# EAGLE design AccessBadgeV1.0 (EAGLE 7.3.0)
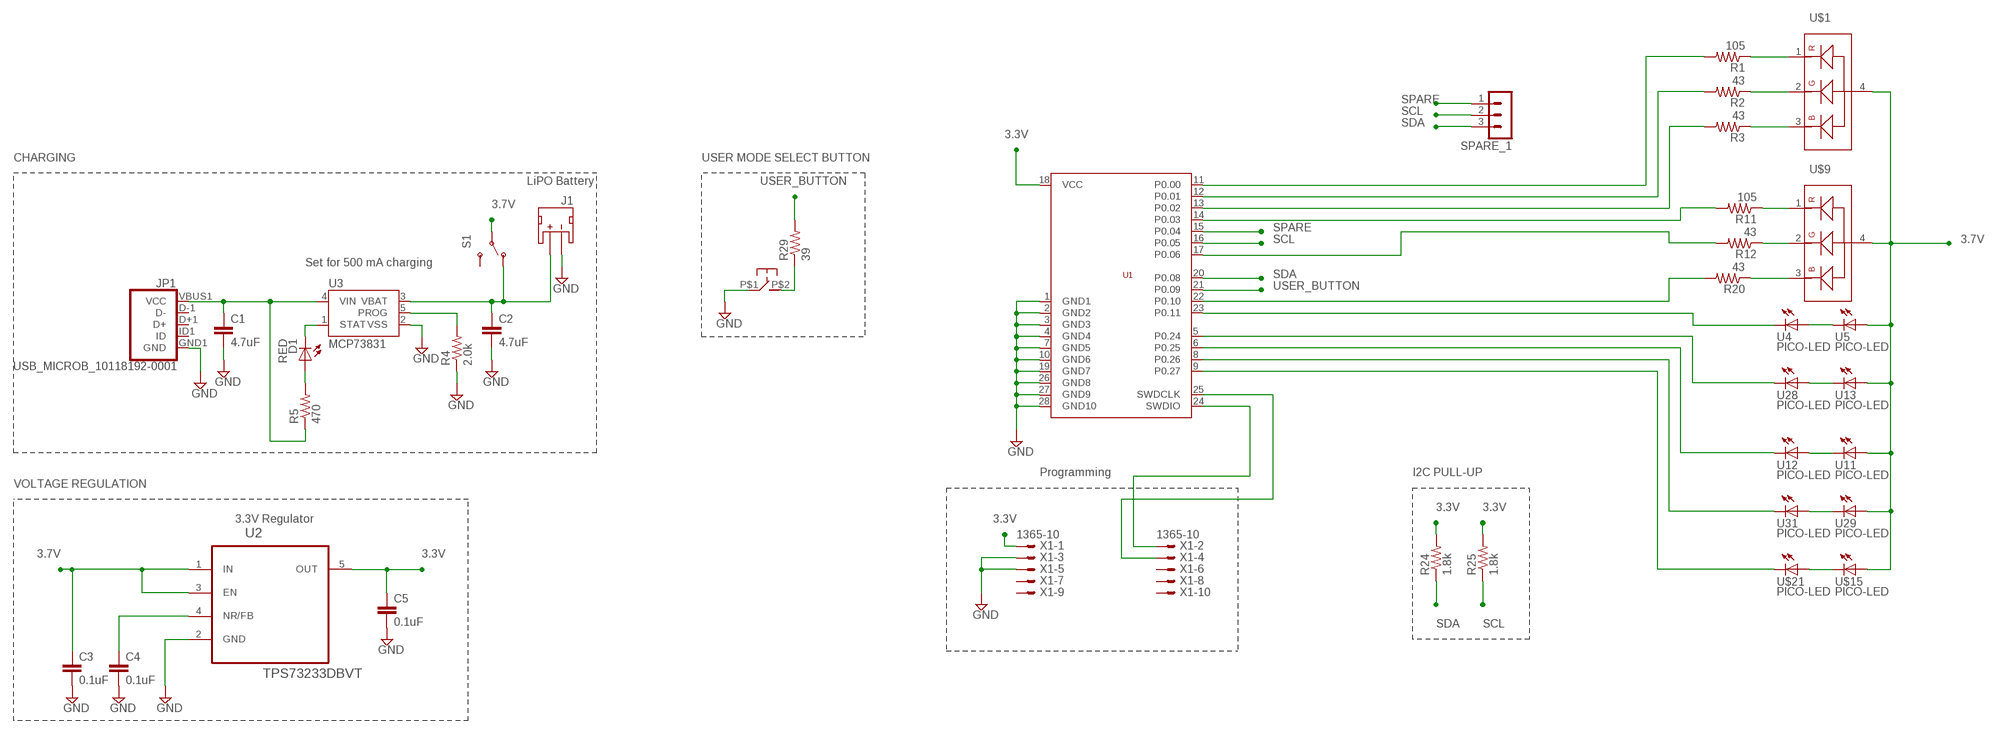
[diagram p0: schematic, sheet 1]

## Parts
C1  4.7uF  CAP0603-CAP  [0603-CAP]
C2  4.7uF  CAP0603-CAP  [0603-CAP]
C3  0.1uF  C-EUC0201  [C0201]
C4  0.1uF  C-EUC0201  [C0201]
C5  0.1uF  C-EUC0201  [C0201]
D1  RED  LEDCHIP-LED0603  [CHIP-LED0603]
J1  JST_2MM_MALE  [JST-2-SMD]
JP1  USB_MICROB_10118192-0001  USB_MICROB_PLUGCONN-11752  [USB-B-MICRO-SMD_V03]
R1  105  R-US_R0201  [R0201]
R2  43  R-US_R0201  [R0201]
R3  43  R-US_R0201  [R0201]
R4  2.0k  R-US_R0201  [R0201]
R5  470  R-US_R0201  [R0201]
R11  105  R-US_R0201  [R0201]
R12  43  R-US_R0201  [R0201]
R20  43  R-US_R0201  [R0201]
R24  1.8k  R-US_R0201  [R0201]
R25  1.8k  R-US_R0201  [R0201]
R29  39  R-US_R0201  [R0201]
S1  SWITCH-SPDTSMD2  [SWITCH-SPDT-SMD]
SLC  TACTILE_BUTTON  [KXT131]
SPARE_1  MA03-1  [MA03-1]
U1  BMD-200  [BMD-200]
U2  TPS73233DBVT  [SOT95P280X145-5N]
U3  MCP73831  [SOT23-5]
U4  PICO-LED  [CHIP-LED0402]
U5  PICO-LED  [CHIP-LED0402]
U11  PICO-LED  [CHIP-LED0402]
U12  PICO-LED  [CHIP-LED0402]
U13  PICO-LED  [CHIP-LED0402]
U28  PICO-LED  [CHIP-LED0402]
U29  PICO-LED  [CHIP-LED0402]
U31  PICO-LED  [CHIP-LED0402]
U$1  RGB  [0606]
U$9  RGB  [0606]
U$15  PICO-LED  [CHIP-LED0402]
U$21  PICO-LED  [CHIP-LED0402]
X1  1365-10  [1365-10]

## Nets
3.3V: C5.1 R24.2 R25.2 U1.18(VCC) U2.5(OUT) X1.1
3.7V: C3.1 S1.2(P) U2.1(IN) U2.3(EN) U5.P$1(A) U11.P$1(A) U13.P$1(A) U29.P$1(A) U$1.4 U$9.4 U$15.P$1(A)
GND: C1.2 C2.2 C3.2 C4.2 C5.2 J1.1(-) JP1.GND1(GND) R4.1 SLC.P$1 U1.1(GND1) U1.2(GND2) U1.3(GND3) U1.4(GND4) U1.7(GND5) U1.10(GND6) U1.19(GND7) U1.26(GND8) U1.27(GND9) U1.28(GND10) U2.2(GND) U3.2(VSS) X1.3 X1.5
N$1: R1.2 U1.11(P0.00)
N$2: R2.2 U1.12(P0.01)
N$3: R3.2 U1.13(P0.02)
N$4: R11.2 U1.14(P0.03)
N$5: U1.5(P0.24) U28.P$2(C)
N$6: U1.9(P0.27) U$21.P$2(C)
N$9: U4.P$1(A) U5.P$2(C)
N$10: U1.23(P0.11) U4.P$2(C)
N$15: R1.1 U$1.1
N$16: R2.1 U$1.2
N$17: R3.1 U$1.3
N$28: R4.2 U3.5(PROG)
N$29: C1.1 JP1.VBUS1(VCC) R5.1 U3.4(VIN)
N$35: D1.A R5.2
N$36: D1.C U3.1(STAT)
N$39: R11.1 U$9.1
N$41: R12.1 U$9.2
N$49: C4.1 U2.4(NR/FB)
N$50: U$15.P$2(C) U$21.P$1(A)
N$52: U29.P$2(C) U31.P$1(A)
N$53: U11.P$2(C) U12.P$1(A)
N$54: U13.P$2(C) U28.P$1(A)
N$64: R20.1 U$9.3
N$66: U1.8(P0.26) U31.P$2(C)
N$67: U1.6(P0.25) U12.P$2(C)
N$69: R20.2 U1.22(P0.10)
N$70: R12.2 U1.17(P0.06)
N$75: R29.1 SLC.P$2
N$76: U1.24(SWDIO) X1.2
N$77: U1.25(SWDCLK) X1.4
SCL: R25.1 SPARE_1.2 U1.16(P0.05)
SDA: R24.1 SPARE_1.3 U1.20(P0.08)
SPARE: SPARE_1.1 U1.15(P0.04)
USER_BUTTON: R29.2 U1.21(P0.09)
VBAT1: C2.1 J1.2(+) S1.1(O) U3.3(VBAT)
Unconnected: J1.NC1(PAD1) J1.NC2(PAD2) JP1.D+1(D+) JP1.D-1(D-) JP1.ID1(ID) S1.3(S) X1.6 X1.7 X1.8 X1.9 X1.10

## Notes on the sheet
- CHARGING | USER MODE SELECT BUTTON
- LiPO Battery
- Set for 500 mA charging
- Programming | I2C PULL-UP
- VOLTAGE REGULATION
- 3.3V Regulator

## Library data of the parts
C1 C2 = SparkFun:CAP: Capacitor Standard 0603 ceramic capacitor, and 0.1" leaded capacitor.
C3-C5 = rcl:C-EU: CAPACITOR, European symbol
D1 = adafruit:LED: LED OSRAM: - CHIPLED LG R971, LG N971, LY N971, LG Q971, LY Q971, LO R971, LY R971 LH N974, LH R974 LS Q976, LO Q976, LY Q976 LO Q996 - Hyper CHIPLED LW Q18S LB Q993, LB Q99A, LB R99A - SideLED LS A670, LO A670, LY A670, LG A670, LP A670 LB A673, LV A673, LT A673, LW A673 LH A674 LY A675 LS A676, LA A676, LO A676, LY A676, LW A676 LS A679, LY A679, LG A679 - Hyper Micro SIDELED® LS Y876, LA Y876, LO Y876, LY Y876 LT Y87S - SmartLED LW L88C, LW L88S LB L89C, LB L89S, LG L890 LS L89K, LO L89K, LY L89K LS L896, LA L896, LO L896, LY L896 - TOPLED LS T670, LO T670, LY T670, LG T670, LP T670 LSG T670, LSP T670, LSY T670, LOP T670, LYG T670 LG T671, LOG T671, LSG T671 LB T673, LV T673, LT T673, LW T673 LH T674 LS T676, LA T676, LO T676, LY T676, LB T676, LH T676, LSB T676, LW T676 LB T67C, LV T67C, LT T67C, LS T67K, LO T67K, LY T67K, LW E67C LS E67B, LA E67B, LO E67B, LY E67B, LB E67C, LV E67C, LT E67C LW T67C LS T679, LY T679, LG T679 LS T770, LO T770, LY T770, LG T770, LP T770 LB T773, LV T773, LT T773, LW T773 LH T774 LS E675, LA E675, LY E675, LS T675 LS T776, LA T776, LO T776, LY T776, LB T776 LHGB T686 LT T68C, LB T68C - Hyper Mini TOPLED® LB M676 - Mini TOPLED Santana® LG M470 LS M47K, LO M47K, LY M47K Source: http://www.osram.convergy.de/
J1 = SparkFun-Connectors:JST_2MM_MALE: Mates to single-cell LiPo batteries. CONN-08352; PROD_ID: CONN-08352
JP1 = SparkFun-Connectors:USB_MICROB_PLUG: USB Micro-B Plug Comes in a variety of packages. Check out Hirose's ZX-x0 line: http://www.hirose.co.jp/cataloge_hp/e24200011.pdf; PROD_ID: CONN-11752
R1-R5 R11 R12 R20 R24 R25 R29 = rcl:R-US_: RESISTOR, American symbol
S1 = SparkFun-Electromechanical:SWITCH-SPDT: SPDT Switch Simple slide switch, Spark Fun Electronics SKU : COM-00102 DPDT SMT slide switch, AYZ0202, SWCH-08179
SLC = C_K_BUTTONS:TACTILE_BUTTON
SPARE_1 = con-lstb:MA03-1: PIN HEADER; OC_FARNELL: unknown; OC_NEWARK: unknown
U1 = BMD-200:BMD-200
U2 = Texas Instruments_By_element14_Batch_1:TPS73233DBVT: Cap-Free, NMOS, 250mA Low Dropout Regulator with Reverse Current Protection; MPN: TPS73233DBVT; OC_FARNELL: -; OC_NEWARK: 87H2968; PACKAGE: SOT-23-5; SUPPLIER: Texas Instruments
U3 = SparkFun:MCP73831: Microchip's MCP73831 Miniature single cell, fully integrated Li-Ion, Li-polymer charge management controller http://ww1.microchip.com/downloads/en/DeviceDoc/21984a.pdf
U4 U5 U11-U13 U28 U29 U31 U$15 U$21 = adafruit:PICO-LED
U$1 U$9 = LITE_ON:RGB
X1 = con-leotronics:1365-10: DUAL ROW STRAIGHT HEADER 1364 SERIES. 1.27mm x 1.27mm. Without Fixing Post. SMT Source: http://www.leotronics.co.uk/Conexcon/Data%20Sheets/sec.%20A/1364ing.pdf; OC_FARNELL: unknown; OC_NEWARK: unknown

## Board
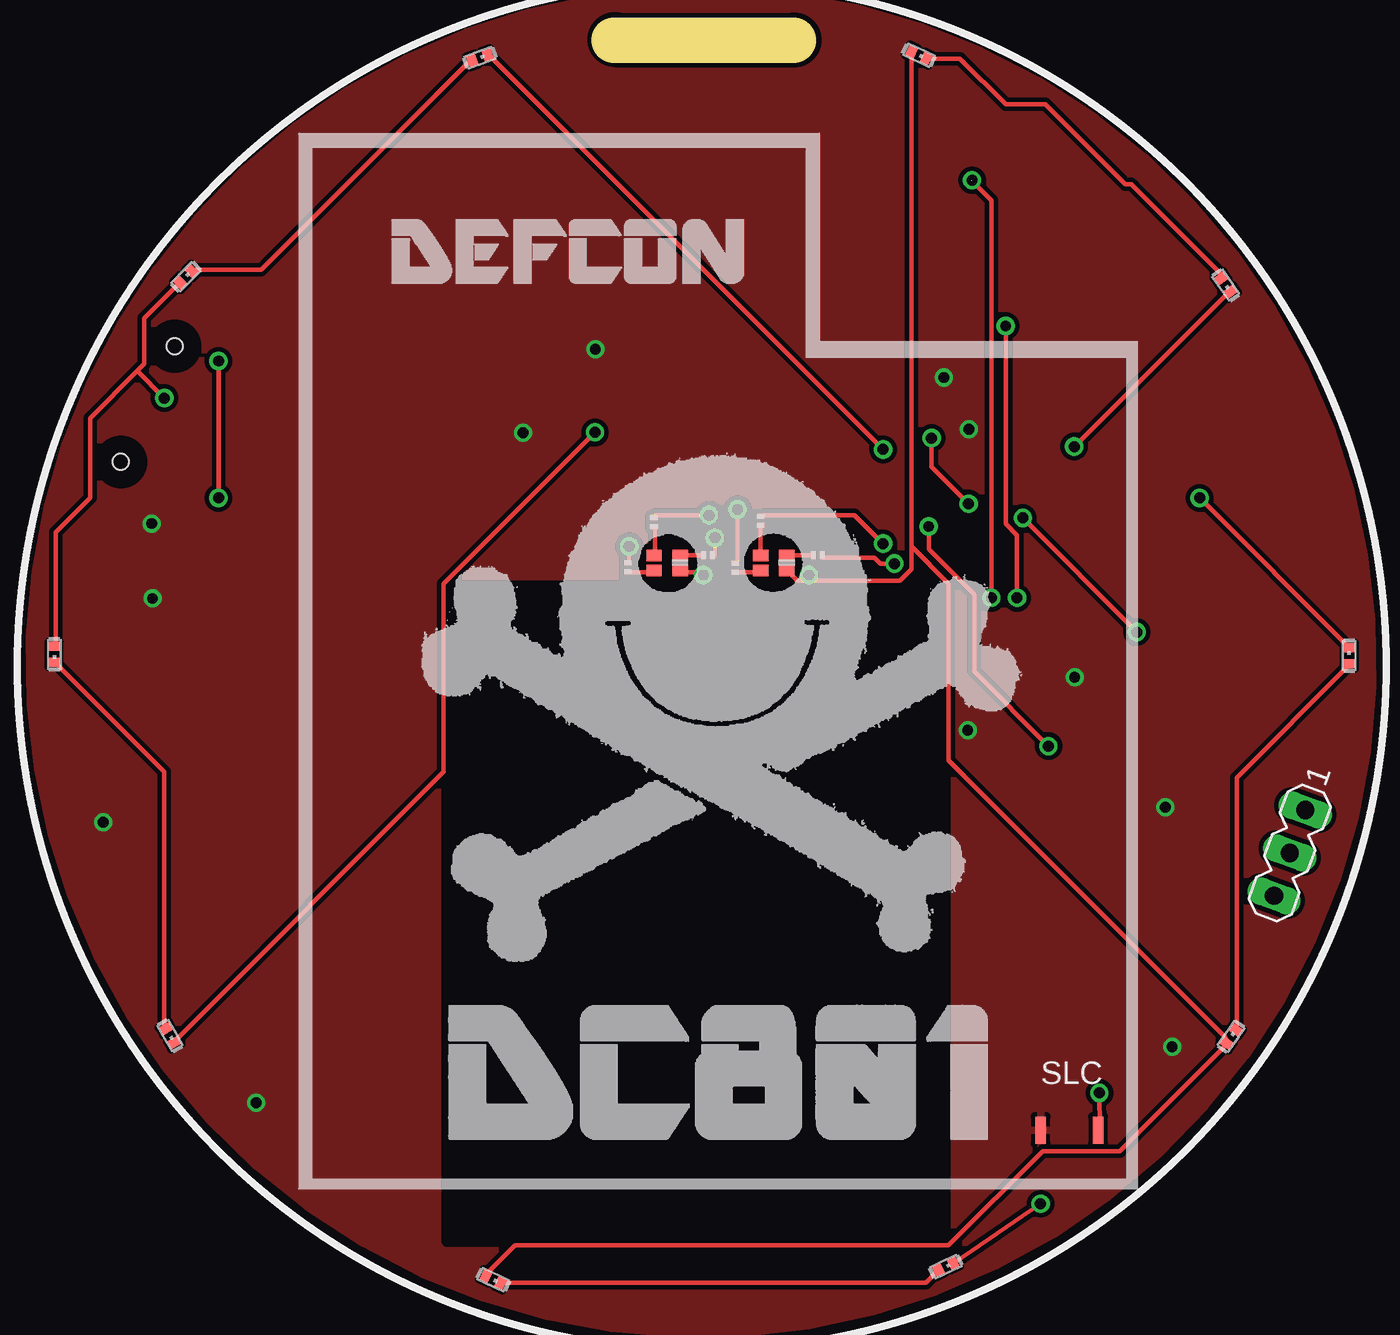
[diagram p1: board, top side]
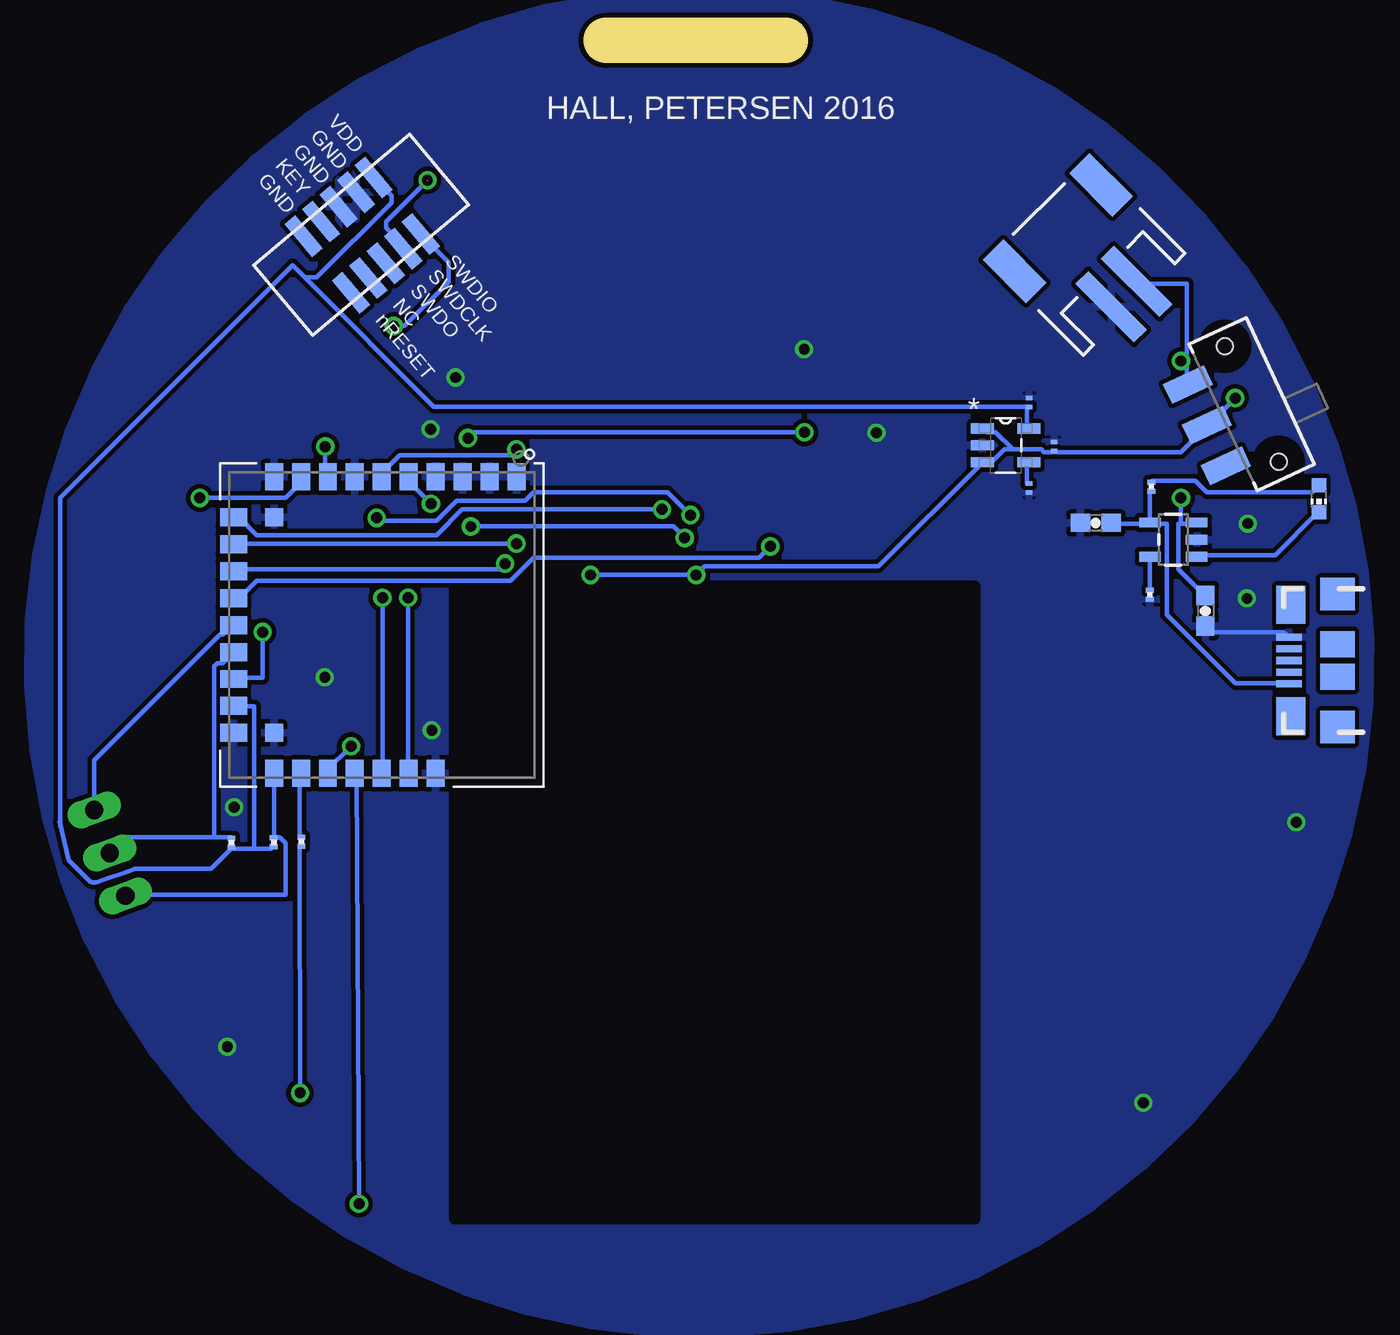
[diagram p2: board, bottom side, seen from below]

No outline drawn. Coordinates in mm, seen from the top.
Copper layers (1*16): Top 0.035mm / dielectric 1.5mm / Bottom 0.035mm
Design rules "default": minimum track width 10mil, minimum drill 24mil, track to track 8mil, track to pad 8mil, pad to pad 8mil, via to via 8mil, smd to smd 8mil, copper to edge 40mil, drill to drill 8mil, minimum pad ring 10mil, minimum via ring 8mil, stop-mask expansion 4mil, vias tented up to drill 0mil, thermal gap 10mil
tRestrict: 1 lines
bRestrict: 1 lines
Milling: 1 lines

### Footprints (pad centres in the part's own frame; a part is rotated, then mirrored left to right if it is on the bottom)
0603-CAP = smd 1.1 x 1: 1 -0.85,0; 2 0.85,0
C0201 = smd 0.25 x 0.35: 1 -0.25,0; 2 0.25,0
CHIP-LED0603 = smd 0.8 x 0.8: A 0,-0.75; C 0,0.75
JST-2-SMD = smd 1 x 4.6: 1 -1,-3.7; 2 1,-3.7 | smd 1.6 x 3.4: NC1 -3.4,1.5; NC2 3.4,1.5
USB-B-MICRO-SMD_V03 = smd 1.4 x 0.4: D+1 2.7,0; D-1 2.7,0.65; GND1 2.7,-1.3; ID1 2.7,-0.65; VBUS1 2.7,1.3 | smd 1.9 x 1.45: P$1 0,-0.9; P$2 0,0.9 | smd 1.9 x 1.8: P$3 0,3.7; P$4 0,-3.7 | smd 1.6 x 2.1: P$5 2.6,3.1; P$6 2.6,-3.1
R0201 = smd 0.28 x 0.43: 1 -0.255,0; 2 0.255,0
SWITCH-SPDT-SMD = smd 1.2 x 2.5: 1 -2.5,-2.75; 2 0,-2.75; 3 2.5,-2.75 | hole 0.9: -3.55,0; 3.55,0
KXT131 = smd 0.6 x 1.5: P$1 0,0; P$2 3.2,0
MA03-1 = drill 1.016 long: 1 -2.54,0; 2 0,0; 3 2.54,0
BMD-200 = smd 1 x 1.5: 1 -7.5,-8.25; 2 -6,-8.25; 3 -4.5,-8.25; 4 -3,-8.25; 5 -1.5,-8.25; 6 0,-8.25; 7 1.5,-8.25; 8 3,-8.25; 9 4.5,-8.25; 10 6,-8.25; 20 6,8.25; 21 4.5,8.25; 22 3,8.25; 23 1.5,8.25; 24 0,8.25; 25 -1.5,8.25; 26 -3,8.25 | smd 1.5 x 1: 11 8.25,-6; 12 8.25,-4.5; 13 8.25,-3; 14 8.25,-1.5; 15 8.25,0; 16 8.25,1.5; 17 8.25,3; 18 8.25,4.5; 19 8.25,6 | smd 1 x 1: 27 6,-6; 28 6,6
SOT95P280X145-5N = smd 1.27 x 0.559: 1 -1.295,0.94; 2 -1.295,0; 3 -1.295,-0.94; 4 1.295,-0.94; 5 1.295,0.94
SOT23-5 = smd 0.55 x 1.2: 1 -0.95,-1.3; 2 0,-1.3; 3 0.95,-1.3; 4 0.95,1.3; 5 -0.95,1.3
CHIP-LED0402 = smd 0.5 x 0.6: P$1 0,0; P$2 0.9,0
0606 = smd 0.65 x 0.85: 1 0,0; 2 0.85,0; 3 0.85,-1.45; 4 0,-1.45
1365-10 = smd 0.76 x 2.4: 1 -2.54,-2.95; 2 -2.54,1.15; 3 -1.27,-2.95; 4 -1.27,1.15; 5 0,-2.95; 6 0,1.15; 7 1.27,-2.95; 8 1.27,1.15; 9 2.54,-2.95; 10 2.54,1.15

### Placement (x,y rotation side)
C1  15.06,47.67 180 bottom
C2  8.96,42.77 270 bottom
C3  17.37,51.92 90 bottom
C4  18.78,49.6 270 bottom
C5  18.78,54.38 90 bottom
D1  2.64,49.01 180 bottom
J1  16.11,63.01 45 bottom
JP1  1.61,40.01 180 bottom
R1  39.08,45.17 90 top
R2  40.5,47.79 90 top
R3  43.69,45.86 0 top
R4  12.05,43.67 90 bottom
R5  11.97,49.68 90 bottom
R11  33.1,45.19 90 top
R12  34.56,47.71 90 top
R20  37.57,45.86 0 top
R24  60.82,29.89 270 bottom
R25  63.17,29.87 270 bottom
R29  59.27,29.93 90 bottom
S1  6.38,54.27 295 bottom
SLC  56.08,13.88 0 top
SPARE_1  69.94,29.3 250 top
U1  54.8,41.98 180 bottom
U2  20.08,51.98 0 bottom
U3  10.75,46.74 90 bottom
U4  50.39,6.1 25 top
U5  25.2,5.75 335 top
U11  8.19,61.04 45 top
U12  24.44,73.4 20 top
U13  1.18,40.8 270 top
U28  7.4,19.53 300 top
U29  48.89,73.88 335 top
U31  66.12,61.26 305 top
U$1  40.5,45.01 90 top
U$9  34.56,45.01 90 top
U$15  66.43,18.71 55 top
U$21  73.25,39.83 90 top
X1  55.31,62.99 220 bottom

### Tracks (layer width: path | path; a pad name or v marks a point on that pad's centre or on a via)
3.3V
  Bottom 0.254: 61.91,29.53 60.96,29.53 R24.2 | 61.91,29.53 63.02,29.53 R25.2 63.18,29.53 64.29,28.42 68.55,28.42 68.58,28.39 arc1 70.67,27.68 arc63 71.12,27.78 72.23,28.89 72.56,30.32 72.72,31.07 72.71,30.8 72.71,49.05 59.77,61.99 59.11,61.33 | 61.91,29.53 61.91,37.47 63.02,37.47 U1.18 | 18.89,54.13 18.89,53.02 U2.5 | 18.89,54.13 51.91,54.13 59.11,61.33 | 18.89,54.13 C5.1 | X1.1 54.25,65.88 54.25,65.49 58.42,61.33 59.11,61.33
3.7V  (via drill 0.61)
  Top 0.254: U5.P$1 25.24,5.87 26.83,7.46 50.96,7.46 56.2,12.7 60.48,12.7 66.36,18.57 U$15.P$1 66.36,18.73 66.36,19.05 50.96,34.45 50.96,44.29 48.9,46.35 | 48.9,46.35 48.9,45.09 48.26,44.45 43.18,44.45 | 48.9,46.35 48.9,73.82 U29.P$1 | 43.18,44.45 42.55,44.45 42.07,44.93 U$1.4 | 5.79,56.12 6.19,56.52 6.19,59.05 8.1,60.96 U11.P$1 | 5.79,56.12 3.17,53.5 3.17,49.05 1.27,47.15 1.27,40.96 U13.P$1 | v37.31,44.77 37.15,44.93 36.04,44.93 U$9.4 | v7.3,54.61 5.79,56.12 | v43.18,44.77 43.18,44.45
  Bottom 0.254: 19.68,51.75 20.16,51.75 20.8,51.12 21.27,51.12 U2.3 21.43,50.96 27.15,45.24 36.83,45.24 v37.31,44.77 v43.18,44.77 | 19.68,51.75 18.1,51.75 17.94,51.59 17.46,51.59 C3.1 17.3,51.59 10.32,51.59 8.89,53.02 S1.2 8.73,53.18 v7.3,54.61 | 19.68,51.75 20.64,52.7 21.11,52.7 21.27,52.86 U2.1
GND  (via drill 0.6)
  Bottom 0.254: JP1.GND1 4.45,41.43 4.6,41.59 8.57,41.59 8.89,41.91 C2.2
  other vias: 31.29,57.32 6.64,43.46 6.6,47.63 27.27,52.69 50.7,55.76 52.08,52.87 63.4,18.51 52.02,36.13 63.01,31.84 57.97,39.08 3.9,31.01 12.42,15.4
  pour Top (isolate 0.254): 9.79,14.44 arc-180 64.56,65.41 arc-180
  pour Bottom (isolate 0.254): 9.75,14.44 arc-180 64.52,65.41 arc-180
N$1  (via drill 0.61)
  Top 0.254: v39.21,48.42 39.21,45.56 R1.2
  Bottom 0.254: v39.21,48.42 50.32,48.42 51.75,46.99 61.75,46.99 62.71,47.94 63.02,47.94 U1.11
N$2  (via drill 0.61)
  Top 0.254: v47.31,46.51 45.72,48.1 40.64,48.1 R2.2
  Bottom 0.254: v47.31,46.51 63.02,46.51 U1.12
N$3  (via drill 0.61)
  Top 0.254: v47.94,45.4 47.15,45.4 46.83,45.72 43.97,45.72 R3.2
  Bottom 0.254: v47.94,45.4 48.26,45.09 63.02,45.09 U1.13
N$4  (via drill 0.61)
  Top 0.254: v33.18,46.35 33.18,45.56 R11.2
  Bottom 0.254: v33.18,46.35 33.81,45.72 46.35,45.72 47.62,44.45 61.75,44.45 62.71,43.5 63.02,43.5 U1.14
N$5  (via drill 0.61)
  Top 0.254: v31.27,52.7 22.86,44.29 22.86,33.81 7.94,18.89 U28.P$2 | v50.01,52.39 50.01,50.8 v52.07,48.74
  Bottom 0.254: v31.27,52.7 49.69,52.7 v50.01,52.39 | v52.07,48.74 53.18,49.85 53.18,50.16 U1.5
N$6  (via drill 0.61)
  Top 0.254: v64.93,49.05 73.18,40.8 U$21.P$2
  Bottom 0.254: v64.93,49.05 60.17,49.05 59.37,49.85 59.37,50.16 U1.9
N$7  (via drill 0.6)
  other vias: 54.13,58.62
N$9
  Top 0.254: U5.P$2 26.04,5.4 49.69,5.4 50.32,6.03 U4.P$1
N$10  (via drill 0.61)
  Top 0.254: v56.08,9.78 51.28,6.51 U4.P$2
  Bottom 0.254: v56.08,9.78 56.2,33.66 U1.23
N$15
  Top 0.254: R1.1 39.21,44.93 40.48,44.93 U$1.1
N$16
  Top 0.254: R2.1 40.48,47.47 40.48,45.88 U$1.2
N$17
  Top 0.254: R3.1 43.34,45.88 42.07,45.88 U$1.3
N$28
  Bottom 0.254: R4.2 12.06,43.97 12.06,45.72 U3.5
N$29
  Bottom 0.254: R5.1 12.06,49.37 12.06,47.78 U3.4 | C1.1 14.13,47.62 12.06,47.62 U3.4 | JP1.VBUS1 4.45,38.73 7.3,38.73 11.11,42.55 11.11,47.62 11.91,47.62 U3.4
N$35
  Bottom 0.254: R5.2 11.91,50.01 9.53,50.01 8.89,49.37 3.02,49.37 2.7,49.69 D1.A
N$36
  Bottom 0.254: D1.C 2.7,48.26 5.08,45.88 9.37,45.88 U3.1
N$39
  Top 0.254: R11.1 33.18,44.93 34.45,44.93 U$9.1
N$41
  Top 0.254: R12.1 34.61,47.47 34.61,45.88 U$9.2
N$49
  Bottom 0.254: C4.1 18.89,49.85 18.89,50.96 U2.4
N$50
  Top 0.254: U$15.P$2 66.99,19.53 66.99,33.5 73.18,39.69 U$21.P$1
N$52
  Top 0.254: U29.P$2 49.85,73.5 51.59,73.5 54.13,70.96 56.36,70.96 60.8,66.52 61.12,66.52 66.04,61.59 66.04,61.28 U31.P$1
N$53
  Top 0.254: U11.P$2 8.89,61.75 12.7,61.75 24.29,73.34 U12.P$1
N$54
  Top 0.254: U28.P$1 7.3,19.68 7.3,33.81 1.27,39.85 U13.P$2
N$64
  Top 0.254: R20.1 37.31,45.88 36.04,45.88 U$9.3
N$66  (via drill 0.61)
  Top 0.254: v57.94,51.91 66.52,60.48 U31.P$2
  Bottom 0.254: v57.94,51.91 57.94,50.32 U1.8
N$67  (via drill 0.61)
  Top 0.254: v47.31,51.75 25.4,73.66 U12.P$2
  Bottom 0.254: v47.31,51.75 47.62,51.44 53.82,51.44 54.93,50.32 U1.6
N$69  (via drill 0.61)
  Top 0.254: v37.94,46.83 37.94,45.88 R20.2 | v49.85,47.47 49.85,46.2 52.39,43.66 52.39,39.37 v56.52,35.24
  Bottom 0.254: v37.94,46.83 38.58,47.47 v49.85,47.47 | v56.52,35.24 57.94,33.81 U1.22
N$70  (via drill 0.61)
  Top 0.254: v37.62,48.1 34.61,48.1 R12.2 | v61.44,41.59 v55.09,47.94
  Bottom 0.254: v37.62,48.1 38.89,49.37 46.35,49.37 46.83,48.9 50.64,48.9 51.75,47.78 54.93,47.78 v55.09,47.94 | v61.44,41.59 61.44,39.05 63.02,39.05 U1.17
N$75  (via drill 0.61)
  Top 0.254: v59.35,15.95 59.37,13.97 SLC.P$2
  Bottom 0.254: v59.35,15.95 59.37,29.69 R29.1
N$76  (via drill 0.6, 0.61)
  Top 0.254: v54.77,43.5 54.77,46.99 54.13,47.62 v54.13,58.62
  Bottom 0.254: v54.77,43.5 54.77,33.81 U1.24 | v54.13,58.62 53.52,58.62 51.08,61.06 51.08,62.18 52.63,63.72 X1.2
N$77  (via drill 0.6, 0.61)  (1 unrouted)
  Top 0.254: v53.34,43.5 53.34,65.61 52.24,66.71
  Bottom 0.254: v53.34,43.5 53.34,33.81 U1.25 | v52.26,66.73 54.56,64.44 54.56,64.09 53.6,63.13 X1.4
SCL
  Bottom 0.254: 64.14,30.16 69.06,30.16 69.85,29.37 SPARE_1.2 | 64.14,30.16 63.18,30.16 R25.1 | 64.14,30.16 64.14,39.69 63.98,39.85 63.66,39.85 63.18,40.32 U1.16
SDA
  Bottom 0.254: 60.8,30.16 60.8,33.66 U1.20 | 60.8,30.16 60.48,30.16 60.17,29.84 60.17,26.99 69.06,26.99 SPARE_1.3 | 60.8,30.16 R24.1
SPARE
  Bottom 0.254: U1.15 63.18,41.91 63.66,41.43 63.82,41.43 70.8,34.45 70.8,31.75 SPARE_1.1
USER_BUTTON
  Bottom 0.254: R29.2 59.37,30.32 59.37,33.66 U1.21
VBAT1  (via drill 0.61)
  Top 0.254: v10.32,56.67 v10.32,49.05
  Bottom 0.254: 10.32,47.62 9.53,47.62 U3.3 | 10.32,47.62 10.48,47.62 10.48,45.09 9.05,43.66 C2.1 | 10,56.67 10,60.96 12.7,60.96 J1.2 | 10,56.67 10,55.4 S1.1 | v10.32,49.05 10.32,47.62 | 10,56.67 v10.32,56.67

### Text on the board
_bsilk: HALL, PETERSEN 2016